# Altium schematic sheet Motor Control.SchDoc
size A3
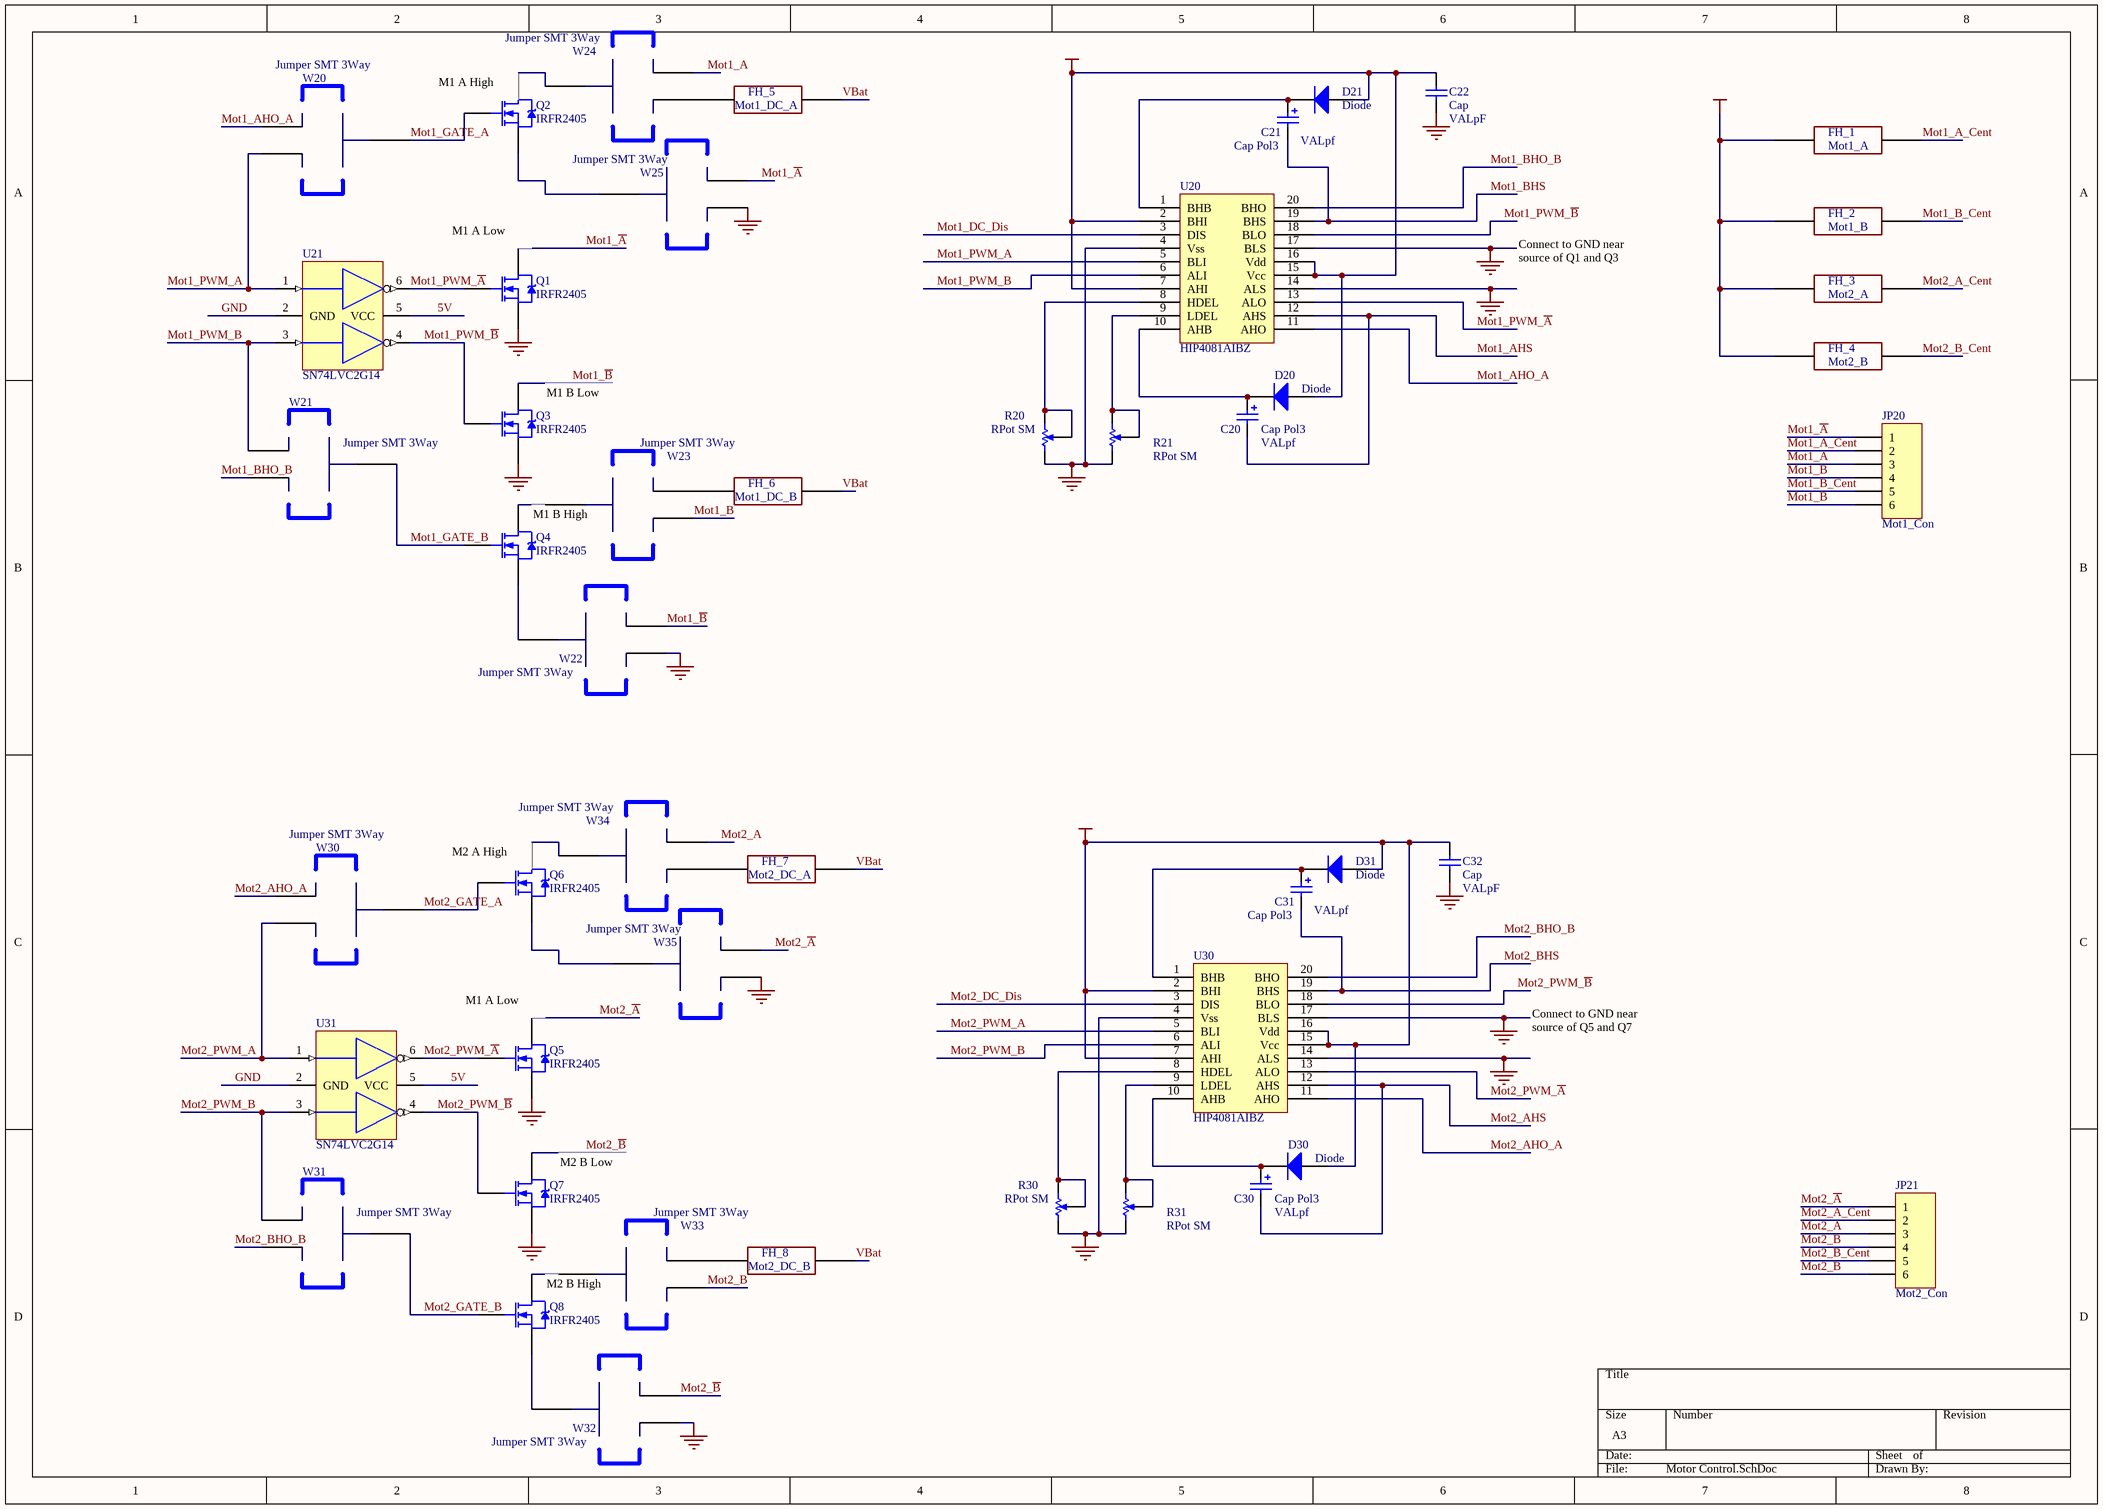
[diagram p0: Motor Control.SchDoc]

## Parts
C20  Cap Pol3  value VALpf  [CC2012-0805]
C21  Cap Pol3  value VALpf  [CC2012-0805]
C22  Cap  value VALpF  [RAD-0.3]
C30  Cap Pol3  value VALpf  [CC2012-0805]
C31  Cap Pol3  value VALpf  [CC2012-0805]
C32  Cap  value VALpF  [RAD-0.3]
D20  Diode  [DSO-C2/X3.3]
D21  Diode  [DSO-C2/X3.3]
D30  Diode  [DSO-C2/X3.3]
D31  Diode  [DSO-C2/X3.3]
FH_1  Mot1_A
FH_2  Mot1_B
FH_3  Mot2_A
FH_4  Mot2_B
FH_5  Mot1_DC_A
FH_6  Mot1_DC_B
FH_7  Mot2_DC_A
FH_8  Mot2_DC_B
JP20  Mot1_Con  [HDR1X6]
JP21  Mot2_Con  [HDR1X6]
Q1  IRFR2405  [TO-252AA]
Q2  IRFR2405  [TO-252AA]
Q3  IRFR2405  [TO-252AA]
Q4  IRFR2405  [TO-252AA]
Q5  IRFR2405  [TO-252AA]
Q6  IRFR2405  [TO-252AA]
Q7  IRFR2405  [TO-252AA]
Q8  IRFR2405  [TO-252AA]
R20  RPot SM  [POT4MM-2]
R21  RPot SM  [POT4MM-2]
R30  RPot SM  [POT4MM-2]
R31  RPot SM  [POT4MM-2]
U20  HIP4081AIBZ  [SOIC20A]
U21  SN74LVC2G14  [SC70]
U30  HIP4081AIBZ  [SOIC20A]
U31  SN74LVC2G14  [SC70]
W20  Jumper SMT 3Way  [Jumper SMT 3 Way]
W21  Jumper SMT 3Way  [Jumper SMT 3 Way]
W22  Jumper SMT 3Way  [Jumper SMT 3 Way]
W23  Jumper SMT 3Way  [Jumper SMT 3 Way]
W24  Jumper SMT 3Way  [Jumper SMT 3 Way]
W25  Jumper SMT 3Way  [Jumper SMT 3 Way]
W30  Jumper SMT 3Way  [Jumper SMT 3 Way]
W31  Jumper SMT 3Way  [Jumper SMT 3 Way]
W32  Jumper SMT 3Way  [Jumper SMT 3 Way]
W33  Jumper SMT 3Way  [Jumper SMT 3 Way]
W34  Jumper SMT 3Way  [Jumper SMT 3 Way]
W35  Jumper SMT 3Way  [Jumper SMT 3 Way]

## Nets
12V: C22.2 C32.2 D20.1(A) D21.1(A) D30.1(A) D31.1(A) U20.2(BHI) U20.7(AHI) U20.15(Vcc) U20.16(Vdd) U30.2(BHI) U30.7(AHI) U30.15(Vcc) U30.16(Vdd)
GND: C22.1 C32.1 Q1.3(S) Q3.3(S) Q5.3(S) Q7.3(S) R20.CCW(-) R21.CCW(-) R30.CCW(-) R31.CCW(-) U20.4(Vss) U20.14(ALS) U20.17(BLS) U21.2(GND) U30.4(Vss) U30.14(ALS) U30.17(BLS) U31.2(GND) W22.3(Out2) W25.3(Out2) W32.3(Out2) W35.3(Out2)
VBat: FH_1.1 FH_2.1 FH_3.1 FH_4.1 FH_5.2 FH_6.2 FH_7.2 FH_8.2
5V: U21.5(VCC) U31.5(VCC)
Mot1_A: JP20.3 W24.2(Out1)
Mot1_~{A}: JP20.1 Q1.4(D) W25.2(Out1)
Mot1_A_Cent: FH_1.2 JP20.2
Mot1_AHO_A: U20.11(AHO) W20.3(Out2)
Mot1_AHS: C20.2 U20.12(AHS)
Mot1_B: JP20.6 W23.3(Out2)
Mot1_~{B}: JP20.4 Q3.4(D) W22.2(Out1)
Mot1_B_Cent: FH_2.2 JP20.5
Mot1_BHO_B: U20.20(BHO) W21.2(Out1)
Mot1_BHS: C21.2 U20.19(BHS)
Mot1_DC_Dis: U20.3(DIS)
Mot1_GATE_A: Q2.1(G) W20.1(In)
Mot1_GATE_B: Q4.1(G) W21.1(In)
Mot1_PWM_A: U20.5(BLI) U21.1(A) W20.2(Out1)
Mot1_PWM_~{A}: Q1.1(G) U20.13(ALO) U21.6(Y)
Mot1_PWM_B: U20.6(ALI) U21.3(A) W21.3(Out2)
Mot1_PWM_~{B}: Q3.1(G) U20.18(BLO) U21.4(Y)
Mot2_A: JP21.3 W34.2(Out1)
Mot2_~{A}: JP21.1 Q5.4(D) W35.2(Out1)
Mot2_A_Cent: FH_3.2 JP21.2
Mot2_AHO_A: U30.11(AHO) W30.3(Out2)
Mot2_AHS: C30.2 U30.12(AHS)
Mot2_B: JP21.6 W33.3(Out2)
Mot2_~{B}: JP21.4 Q7.4(D) W32.2(Out1)
Mot2_B_Cent: FH_4.2 JP21.5
Mot2_BHO_B: U30.20(BHO) W31.2(Out1)
Mot2_BHS: C31.2 U30.19(BHS)
Mot2_DC_Dis: U30.3(DIS)
Mot2_GATE_A: Q6.1(G) W30.1(In)
Mot2_GATE_B: Q8.1(G) W31.1(In)
Mot2_PWM_A: U30.5(BLI) U31.1(A) W30.2(Out1)
Mot2_PWM_~{A}: Q5.1(G) U30.13(ALO) U31.6(Y)
Mot2_PWM_B: U30.6(ALI) U31.3(A) W31.3(Out2)
Mot2_PWM_~{B}: Q7.1(G) U30.18(BLO) U31.4(Y)
NetC20_1: C20.1 D20.2(K) U20.10(AHB)
NetC21_1: C21.1 D21.2(K) U20.1(BHB)
NetC30_1: C30.1 D30.2(K) U30.10(AHB)
NetC31_1: C31.1 D31.2(K) U30.1(BHB)
NetFH_5_1: FH_5.1 W24.3(Out2)
NetFH_6_1: FH_6.1 W23.2(Out1)
NetFH_7_1: FH_7.1 W34.3(Out2)
NetFH_8_1: FH_8.1 W33.2(Out1)
NetQ2_3: Q2.3(S) W25.1(In)
NetQ2_4: Q2.4(D) W24.1(In)
NetQ4_3: Q4.3(S) W22.1(In)
NetQ4_4: Q4.4(D) W23.1(In)
NetQ6_3: Q6.3(S) W35.1(In)
NetQ6_4: Q6.4(D) W34.1(In)
NetQ8_3: Q8.3(S) W32.1(In)
NetQ8_4: Q8.4(D) W33.1(In)
NetR20_CW: R20.CW(+) R20.W U20.8(HDEL)
NetR21_CW: R21.CW(+) R21.W U20.9(LDEL)
NetR30_CW: R30.CW(+) R30.W U30.8(HDEL)
NetR31_CW: R31.CW(+) R31.W U30.9(LDEL)

## Notes on the sheet
- (near Q2) M1 A High
- (near Q1) M1 A Low
- Connect to GND near source of Q1 and Q3
- (near Q3) M1 B Low
- (near W23) M1 B High
- (near Q6) M2 A High
- (near Q5) M1 A Low
- Connect to GND near source of Q5 and Q7
- (near Q7) M2 B Low
- (near W33) M2 B High

## Library data of the parts
C20 C21 C30 C31 = Cap Pol3: Polarized Capacitor (Surface Mount); Published: 8-Jun-2000; Revision: July-2002: Re-released for DXP Platform.; Publisher: Altium Limited
C22 C32 = Cap: Capacitor; Published: 8-Jun-2000; Revision: July-2002: Re-released for DXP Platform.; Publisher: Altium Limited
D20 D21 D30 D31 = Diode: Default Diode; Code - JEDEC: DO-214-AB; Published: 8-Jun-2000; Revision: July-2002: Re-released for DXP Platform.; Publisher: Altium Limited
FH_1-FH_8 = Fuse_Holder: Fuse Holder
JP20 JP21 = Header 6: Header, 6-Pin; Revision: 17-Jul-2002: Re-released for DXP Platform.; Publisher: Altium Limited
Q1-Q8 = IRFR2405: HEXFET Power MOSFET; Note: Pin 2 is trimmed and not drawn; Code - JEDEC: TO-252-AA; Published: 17-Sep-2003; Datasheet: Latest Revision: 1-Mar-2000; Package Reference: TO-252AA; Publisher: Altium Limited
R20 R21 R30 R31 = RPot SM: Square Trimming Potentiometer; Published: 17-Dec-2003; Datasheet: Latest Revision: Oct-2003; Publisher: Altium Limited
U20 U30 = HIP4081AIBZ: 80V/2.5A Peak, High Frequency Full Bridge FET Driver
U21 U31 = SN74LVC2G14: Dual Schmitt-Trigger Inverter; Package Information: Latest Revision: May-1999; Code - JEDEC: MO-203; Published: 8-Jun-2000; Revision: 17-Jul-2002: Re-released for DXP Platform.; Datasheet: Latest Revision: Jul-1995; Package Reference: DB014; Publisher: Altium Limited